# EAGLE design MISW_1.3_128x64_OLED (EAGLE 6.6.0)
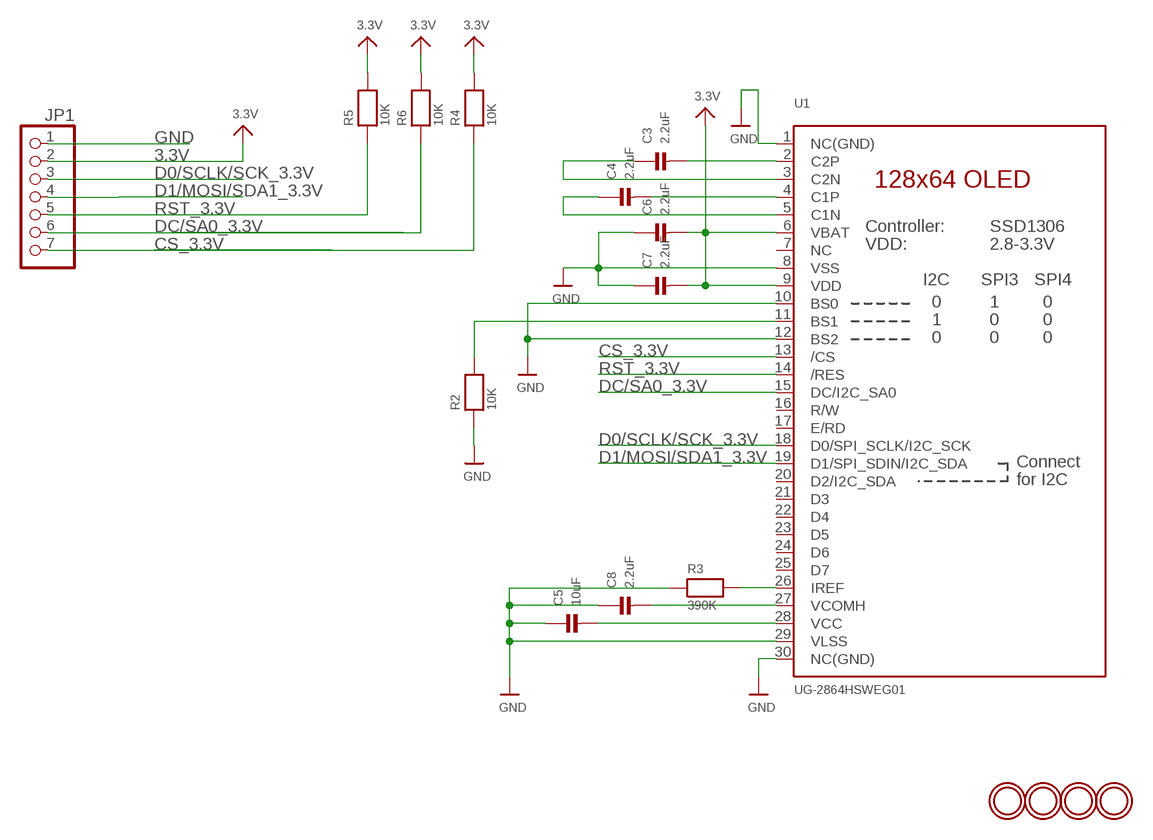
[diagram p0: schematic, sheet 1]

## Parts
C3  2.2uF  CAP_CERAMIC0603MINI  [0603-MINI]
C4  2.2uF  CAP_CERAMIC0603MINI  [0603-MINI]
C5  10uF  CAP_CERAMIC0603MINI  [0603-MINI]
C6  2.2uF  CAP_CERAMIC0603MINI  [0603-MINI]
C7  2.2uF  CAP_CERAMIC0603MINI  [0603-MINI]
C8  2.2uF  CAP_CERAMIC0603MINI  [0603-MINI]
JP1  HEADER-1X7ROUND  [1X07_ROUND]
R2  10K  RESISTOR0603MINI  [0603-MINI]
R3  390K  RESISTOR0603MINI  [0603-MINI]
R4  10K  RESISTOR0603MINI  [0603-MINI]
R5  10K  RESISTOR0603MINI  [0603-MINI]
R6  10K  RESISTOR0603MINI  [0603-MINI]
U1  UG-2864HSWEG01  DISP_OLED_UG-2864HSWEG01  [UG-2864HSWEG01_1.3_WRAPAROUND]
U$23  MOUNTINGHOLE2.5  [MOUNTINGHOLE_2.5_PLATED]
U$24  MOUNTINGHOLE2.5  [MOUNTINGHOLE_2.5_PLATED]
U$25  MOUNTINGHOLE2.5  [MOUNTINGHOLE_2.5_PLATED]
U$26  MOUNTINGHOLE2.5  [MOUNTINGHOLE_2.5_PLATED]

## Nets
3.3V: C6.2 C7.2 JP1.2 R4.2 R5.2 R6.2 U1.6(VBAT) U1.9(VDD)
CS_3.3V: JP1.7 R4.1 U1.13(/CS)
D0/SCLK/SCK_3.3V: JP1.3 U1.18(D0/SPI_SCLK/I2C_SCK)
D1/MOSI/SDA1_3.3V: JP1.4 U1.19(D1/SPI_SDIN/I2C_SDA)
DC/SA0_3.3V: JP1.6 R6.1 U1.15(DC/I2C_SA0)
GND: C5.1 C6.1 C7.1 C8.1 JP1.1 R2.1 R3.1 U1.1(NC(GND)) U1.8(VSS) U1.10(BS0) U1.12(BS2) U1.29(VLSS) U1.30(NC(GND))
N$1: R2.2 U1.11(BS1)
N$3: R3.2 U1.26(IREF)
N$4: C3.2 U1.2(C2P)
N$5: C3.1 U1.3(C2N)
N$6: C4.2 U1.4(C1P)
N$7: C4.1 U1.5(C1N)
N$11: C5.2 U1.28(VCC)
N$12: C8.2 U1.27(VCOMH)
RST_3.3V: JP1.5 R5.1 U1.14(/RES)
Unconnected: U1.7(NC) U1.16(R/W) U1.17(E/RD) U1.20(D2/I2C_SDA) U1.21(D3) U1.22(D4) U1.23(D5) U1.24(D6) U1.25(D7)

## Library data of the parts
C3-C8 = microbuilder:CAP_CERAMIC: Ceramic Capacitors 0402 - 0402 Surface Mount Capacitors 16pF 50V 5% [Digikey: 445-4899-2-ND] 18pF 50V 5% [Digikey: 490-1281-2-ND] 22pF 50V 5% [Digikey: 490-1283-2-ND] 68pF 50V 5% [Digikey: 490-1289-2-ND] 0.1uF 10V 10% [Digikey: 490-1318-2-ND] 1.0uF 6.3V 10% [Digikey: 490-1320-2-ND] 0603 - 0603 Surface Mount Capacitors 16 pF 50V 5% [Digikey: 445-5051-2-ND] 22 pF 50V [Digikey: PCC220ACVTR-ND] 33 pF 50V 5% [Digikey: 490-1415-1-ND] 56pF 50V 5% [Digikey: 490-1421-1-ND] 220pF 50V 5% [Digikey: 445-1285-1-ND] 680 pF 50V 2200 pF 50V 5% C0G [Digikey: 445-1297-1-ND] 5600 pF 100V 5% X7R [Digikey: 478-3711-1-ND] 0.1 µF 25V 10% [Digikey: PCC2277TR-ND] 0.22 µF 16V 10% X7R [Digikey: 445-1318-1-ND] 1.0 µF 25V 10% [Digikey: 445-5146-2-ND] 0603 - RF Specific 3pF 250V +/-0.1pF RF [Digikey: 712-1347-1-ND] 18 pF 250V 5% [Digikey: 478-3505-1-ND or 712-1322-1-ND] 56 pF 250V 5% C0G RF [Digikey: 490-4867-1-ND] 68 pF 250V RF [Digikey: 490-4868-1-ND] 0805 - 0805 Surface Mount Capacitors 220 pF 250V 2% RF Ceramic Capacitor [Digikey: 712-1398-1-ND] 1000 pF 50V 2% NP0 Ceramic Capacitor [Digikey: 478-3760-1-ND] 0.1 µF 25V 10% Ceramic Capacitor [Digikey: PCC1828TR-ND] 1.0 µF 16V 10% Ceramic Capacitor[Digikey: 490-1691-2-ND] 10.0 µF 10V 10% Ceramic Capacitor[Digikey: 709-1228-1-ND] 10.0 uF 16V 10% Ceramic Capacitor [Digikey: 478-5165-2-ND] 47 uF 6.3V 20% Ceramic Capacitor [Digikey: 587-1779-1-ND or 399-5506-1-ND] 1206 - 1206 Surface Mount Capacitors 47uF 10V 20% Ceramic Capacitor [Digikey: 490-5528-1-ND or 399-5508-1-ND or 445-6010-1-ND] 100uF 6.3V -20%, +80% Y5V Ceramic Capacitor (Digikey: 490-4512-1-ND, Mouser: 81-GRM31CF50J107ZE1L)
JP1 = microbuilder:HEADER-1X7: PIN HEADER
R2-R6 = microbuilder:RESISTOR: Resistors 0402 - 0402 Surface Mount Package 22 Ohm 1% 1/16W [Digikey: 311-22.0LRTR-ND] 33 Ohm 5% 1/16W 1.0K 5% 1/16W 1.5K 5% 1/16W 2.0K 1% 1/16W 10.0K 1% 1/16W [Digikey: 311-10.0KLRTR-ND] 10.0K 5% 1/16W [Digikey: RMCF0402JT10K0TR-ND] 12.1K 1% 1/16W [Digikey: 311-22.0LRTR-ND] 100.0K 5% 1/16W 0603 - 0603 Surface Mount Package 0 Ohm 1/10 Watt 1% Resistor 15 Ohm 1/10 Watt 1% Resistor 33 Ohm 1/10 Watt 1% Resistor 49.9 Ohm 1/10 Watt 1% Resistor 100 Ohm 1/10 Watt 1% Resistor 150 Ohm 1/10 Watt 1% Resistor 240 Ohm 1/10 Watt 1% Resistor 390 Ohm 1/10 Watt 1% Resistor 560 Ohm 1/10 Watt 1% Resistor 680 Ohm 1/10 Watt 1% Resistor 750 Ohm 1/10 Watt 1% Resistor 1.0K Ohm 1/10 Watt 1% Resistor 1.5K Ohm 1/10 Watt 1% Resistor 2.0K Ohm 1/10 Watt 1% Resistor 2.2K Ohm 1/10 Watt 1% Resistor 3.3K Ohm 1/10 Watt 1% Resistor 4.7K Ohm 1/10 Watt 1% Resistor 10.0K Ohm 1/10 Watt 1% Resistor 12.0K Ohm 1/10 Watt 1% Resistor 12.1K Ohm 1/10 Watt 1% Resistor 20.0K Ohm 1/10 Watt 1% Resistor 33.0K Ohm 1/10 Watt 1% Resistor 100.0K Ohm 1/10 Watt 1% Resistor 0805 - 0805 Surface Mount Package 0 Ohm 1/8 Watt 1% Resistor 33 Ohm 1/8 Watt 1% Resistor 100 Ohm 1/8 Watt 1% Resistor 150 Ohm 1/8 Watt 1% Resistor 200 Ohm 1/8 Watt 1% Resistor 240 Ohm 1/8 Watt 1% Resistor 330 Ohm 1/8 Watt 1% Resistor 390 Ohm 1/8 Watt 1% Resistor 470 Ohm 1/8 Watt 1% Resistor 1.0K Ohm 1/8 Watt 1% Resistor 1.5K Ohm 1/8 Watt 1% Resistor 2.0K Ohm 1/8 Watt 1% Resistor 4.7K Ohm 1/8 Watt 1% Resistor 5.1K Ohm 1/8 Watt 1% Resistor 5.6K Ohm 1/8 Watt 1% Resistor 10.0K Ohm 1/8 Watt 1% Resistor 22.0K Ohm 1/8 Watt 1% Resistor 33.0K Ohm 1/8 Watt 1% Resistor 100K Ohm 1/8 Watt 1% Resistor 1206 - 1206 Surface Mount Package 2012 - 2010 Surface Mount Package 0.11 Ohm 1/2 Watt 1% Resistor - Digikey: RHM.11UCT-ND
U1 = microbuilder:DISP_OLED_UG-2864HSWEG01: UG-2864HSWEG01 OLED display Both 1.3" and 0.96" models share the same FPC tab footprint, only the screen dimensions vary.
U$23-U$26 = microbuilder:MOUNTINGHOLE: Mounting Hole For #2 screws (0.086"/2.18mm width, 0.094"/2.4mm hole) use 2.5mm

## Board
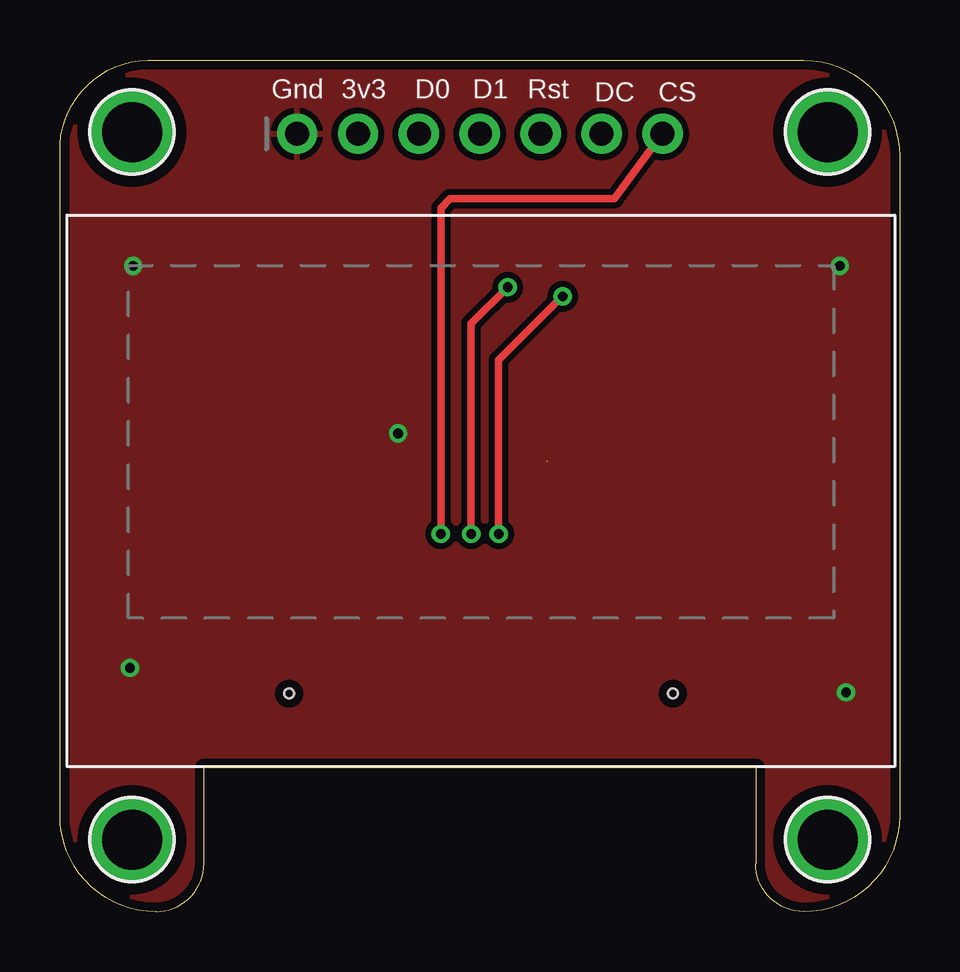
[diagram p1: board, top side]
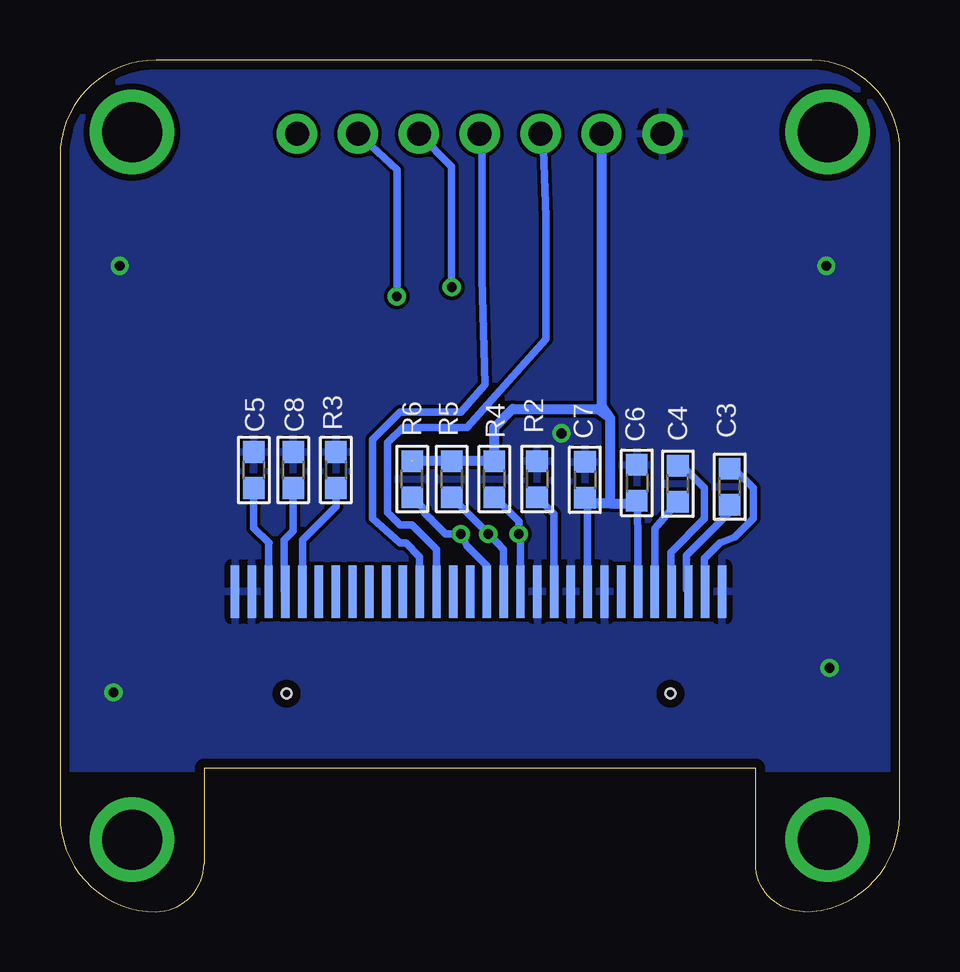
[diagram p2: board, bottom side, seen from below]

Size 35 x 35.51 mm. Coordinates in mm from the lower left corner, seen from the top.
Outline: 0,4 0,32 arc-90 4,35.5 31,35.5 arc-90 35,31.5 35,4 arc-90 31,0 arc-90 29,2 29,6 6,6 6,2 arc-90 4,0 arc-90 0,4
Copper layers (1*16): Top 0.0356mm / dielectric 1.5011mm / Bottom 0.0356mm
Design rules "LaenPCBOrder": minimum track width 6mil, minimum drill 13mil, track to track 6mil, track to pad 6mil, pad to pad 6mil, via to via 6mil, smd to smd 6mil, copper to edge 15mil, drill to drill 6mil, minimum pad ring 7mil, minimum via ring 7mil, stop-mask expansion 4mil, vias tented up to drill 0mil, thermal gap 10mil

### Footprints (pad centres in the part's own frame; a part is rotated, then mirrored left to right if it is on the bottom)
0603-MINI = smd 0.9 x 0.9: 1 -0.75,0; 2 0.75,0
1X07_ROUND = drill 1 pad 1.676: 1 -7.62,0; 2 -5.08,0; 3 -2.54,0; 4 0,0; 5 2.54,0; 6 5.08,0; 7 7.62,0
UG-2864HSWEG01_1.3_WRAPAROUND = smd 0.35 x 2.2 bottom: 1 -10.15,-0.2; 2 -9.45,-0.2; 3 -8.75,-0.2; 4 -8.05,-0.2; 5 -7.35,-0.2; 6 -6.65,-0.2; 7 -5.95,-0.2; 8 -5.25,-0.2; 9 -4.55,-0.2; 10 -3.85,-0.2; 11 -3.15,-0.2; 12 -2.45,-0.2; 13 -1.75,-0.2; 14 -1.05,-0.2; 15 -0.35,-0.2; 16 0.35,-0.2; 17 1.05,-0.2; 18 1.75,-0.2; 19 2.45,-0.2; 20 3.15,-0.2; 21 3.85,-0.2; 22 4.55,-0.2; 23 5.25,-0.2; 24 5.95,-0.2; 25 6.65,-0.2; 26 7.35,-0.2; 27 8.05,-0.2; 28 8.75,-0.2; 29 9.45,-0.2; 30 10.15,-0.2 | hole 0.4: -8,-4.45; 8,-4.45
MOUNTINGHOLE_2.5_PLATED = drill 2.5 pad 3.2: P$1 0,0

### Placement (x,y rotation side)
C3  7.08,17.71 90 bottom
C4  9.24,17.84 90 bottom
C5  26.92,18.41 270 bottom
C6  10.95,17.88 270 bottom
C7  13.12,18 270 bottom
C8  25.27,18.41 270 bottom
JP1  17.5,32.43 0 top
R2  15.11,18.03 270 bottom
R3  23.5,18.41 270 bottom
R4  16.89,18.03 90 bottom
R5  18.67,18.03 90 bottom
R6  20.32,18.03 90 bottom
U1  17.55,13.54 0 top
U$23  32,32.5 0 top
U$24  3,3 0 top
U$25  32,3 0 top
U$26  3,32.5 0 top

### Tracks (layer width: path | path; a pad name or v marks a point on that pad's centre or on a via)
3.3V  (1 unrouted)
  Bottom 0.305: C6.2 10.9,15.82 U1.6 | U1.9 13,17.14 C7.2 | 12.42,32.54 JP1.2
  Bottom 0.406: 12.42,32.54 12.42,21.11 12.06,20.57 | 12.06,20.57 12.06,20.19 12.06,17.02 | 12.06,17.02 11.19,17.02 C6.2 | 12.06,17.02 12.88,17.02 C7.2 | 20.32,18.8 20.31,18.78 R5.2 R4.2 16.89,20.19 16.13,20.95 12.57,20.95 12.06,20.57
CS_3.3V  (via drill 0.41 pad 0.25)
  Top 0.305: v15.88,15.75 15.88,28.7 15.88,29.34 16.26,29.72 21.34,29.72 | 21.34,29.72 21.64,29.72 | JP1.7 23.11,29.72 21.34,29.72
  Bottom 0.305: U1.13 15.8,15.68 v15.88,15.75 15.88,16.27 R4.1
D0/SCLK/SCK_3.3V
  Bottom 0.305: U1.18 19.3,15.11 20.32,16.13 20.83,16.13 21.34,16.64 21.34,19.56 20.7,20.19 18.03,20.19 14.73,23.88 14.73,27.56 | 14.73,27.56 14.73,28.96 | 14.73,28.96 14.86,32.33 JP1.3 | 14.73,27.56 14.73,28.96
D1/MOSI/SDA1_3.3V
  Bottom 0.305: U1.19 20,14.79 20.57,15.37 20.83,15.37 21.97,16.38 21.97,19.68 20.83,20.83 18.29,20.83 17.27,21.97 17.4,26.42 17.4,32.41 JP1.4
DC/SA0_3.3V  (via drill 0.41 pad 0.25)
  Top 0.305: v18.29,15.75 18.29,22.86 18.29,22.99 v20.95,25.65
  Bottom 0.305: U1.15 17.2,14.41 18.03,15.24 v18.29,15.75 18.92,15.75 19.43,16.26 19.56,16.38 19.57,16.38 19.81,16.62 19.81,16.77 R6.1 | v20.95,25.65 20.95,30.93 JP1.6
GND  (via drill 0.41 pad 0.25)
  other vias: 14.1,19.94 3.05,26.92 2.92,10.16 32.77,9.14 32.51,26.92
  pour Top (isolate 0.254): 0,-1 0,35.75 35.56,35.75 35.56,-1
  pour Bottom: 0,6.22 -0.25,12.45 0,35.81 35.18,35.81 35.18,5.97 -0.25,5.97
N$1
  Bottom 0.305: U1.11 14.4,16.57 R2.2
N$3
  Bottom 0.305: R3.2 23.5,16.89 24.89,15.49 24.89,13.35 U1.26
N$4
  Bottom 0.305: C3.2 6.91,18.46 6.1,17.65 6.1,16.38 6.86,15.62 7.49,15.37 8.13,14.73 8.13,13.37 U1.2
N$5
  Bottom 0.305: C3.1 7.08,16.67 8.89,14.86 8.89,13.43 U1.3
N$6
  Bottom 0.305: C4.2 9.07,18.59 8.13,17.65 8.13,16.38 9.53,14.99 9.53,13.37 U1.4
N$7
  Bottom 0.305: C4.1 10.2,15.98 U1.5
N$11
  Bottom 0.305: C5.2 26.92,16 26.29,15.37 26.3,15.35 U1.28
N$12
  Bottom 0.305: C8.2 25.27,15.88 25.65,15.49 25.65,13.39 U1.27
RST_3.3V  (via drill 0.41 pad 0.25)
  Top 0.305: v17.14,15.75 17.14,22.73 17.14,24.51 v18.67,26.04
  Bottom 0.305: U1.14 16.5,15.11 16.76,15.37 v17.14,15.75 17.78,16.38 17.78,16.39 R5.1 | v18.67,26.04 18.67,31.06 JP1.5

### Text on the board
tPlace: Gnd | 3v3 | D0 | D1 | Rst | DC | CS